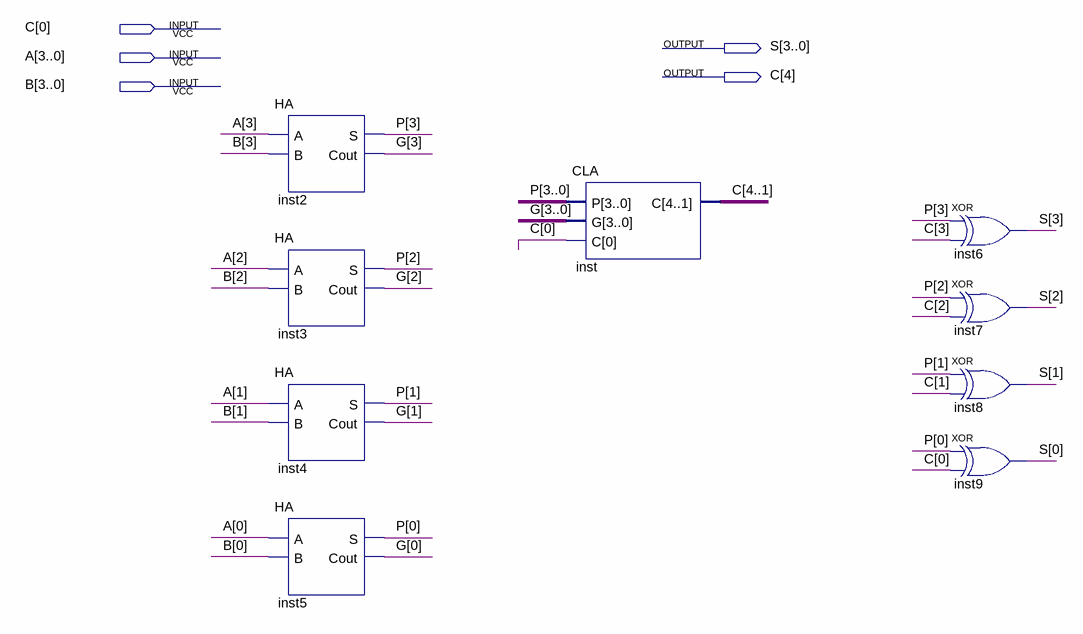
[diagram p0: schematic sheet]
// Quartus schematic SCLA.bdf as structural Verilog: 9 symbols, 5 pins
module SCLA (
  inout  [4:0] C,
  input  [3:0] A,
  input  [3:0] B,
  output [3:0] S
);

  wire [3:0] G, P;

  HA inst2 (.A(A[3]), .B(B[3]), .S(P[3]), .Cout(G[3]));
  HA inst3 (.A(A[2]), .B(B[2]), .S(P[2]), .Cout(G[2]));
  HA inst4 (.A(A[1]), .B(B[1]), .S(P[1]), .Cout(G[1]));
  HA inst5 (.A(A[0]), .B(B[0]), .S(P[0]), .Cout(G[0]));
  CLA inst (.P(P), .G(G), .C(C));
  xor inst6 (S[3], P[3], C[3]);
  xor inst7 (S[2], P[2], C[2]);
  xor inst8 (S[1], P[1], C[1]);
  xor inst9 (S[0], P[0], C[0]);
endmodule
